# EasyEDA schematic EasyEDA-SCH_IoT-Indoor-Climate-Sensor-upgraded_2025-12-03.json
TITLE: Indoor-Climate-Sensor; REV: 2.0; Date: 2025-01-12; Sheet: 1/1; Company: H4 - D15
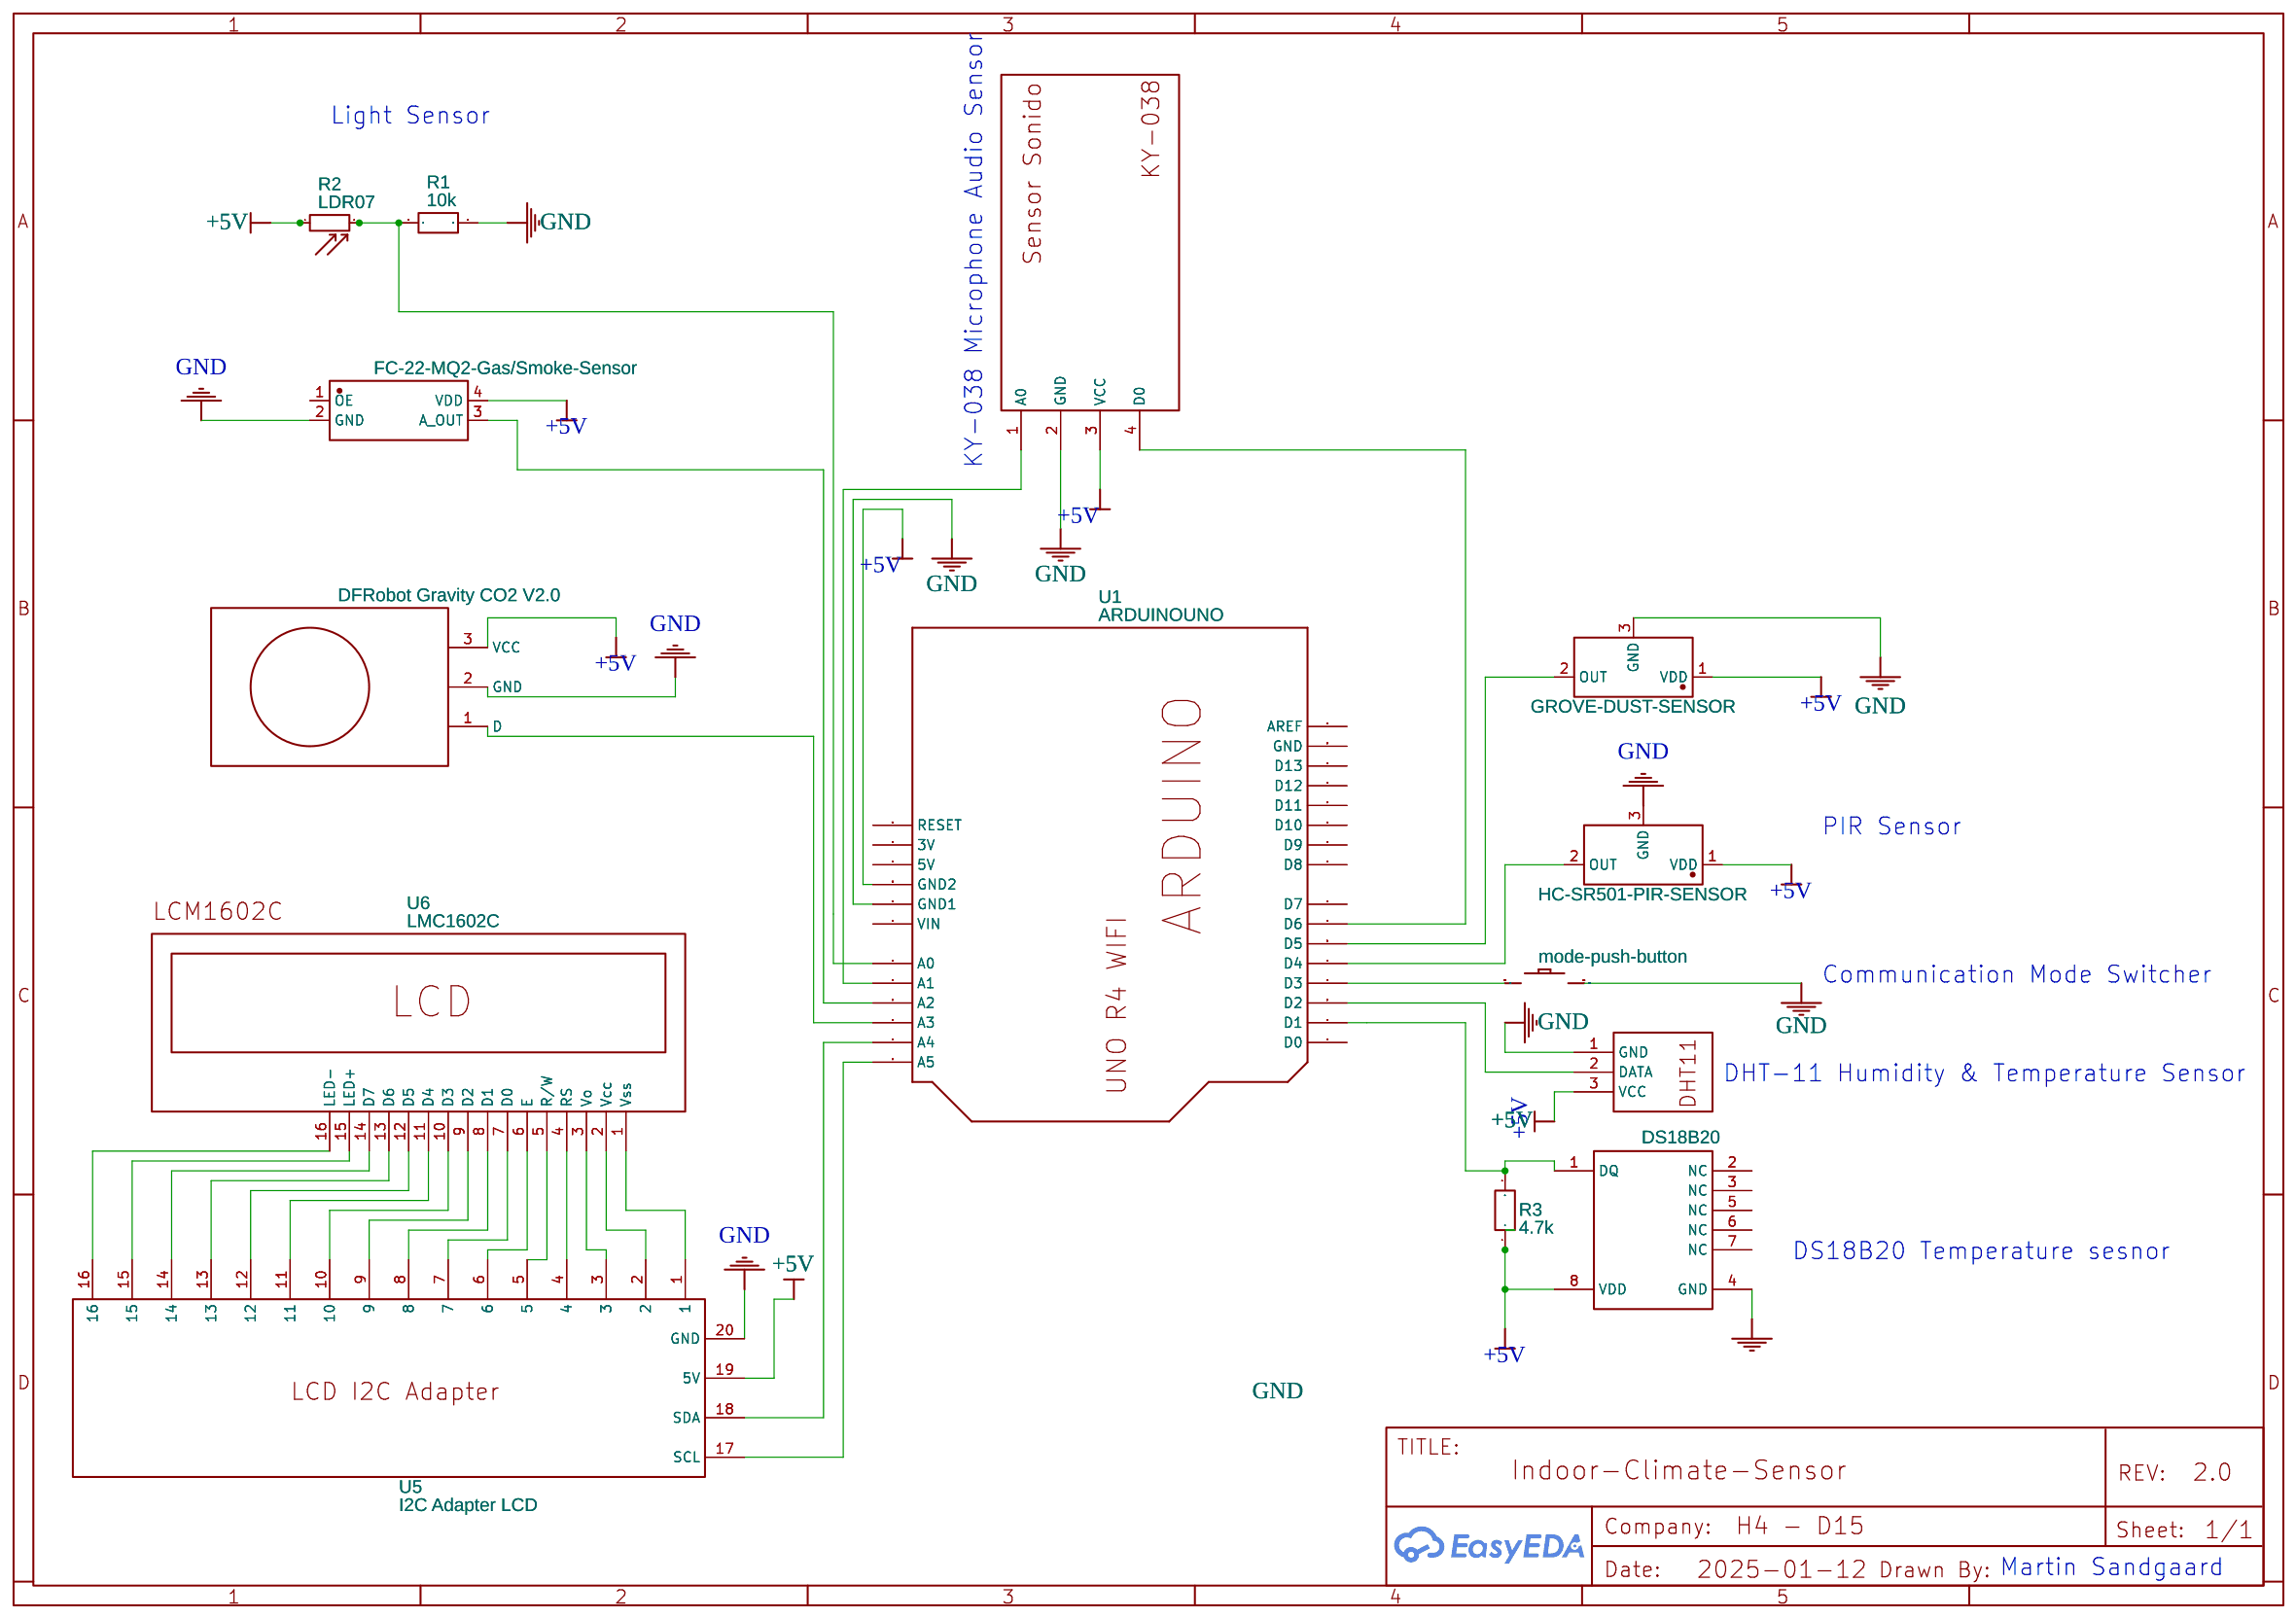
[diagram p0: schematic sheet]

## Parts
1  mode-push-button  [32TEETH---CONDUCTIVE-BUTTONS_CONDUCTIVE_BUTTON_DIRECTIONAL_THICK]
GROVE-DUST-SENSOR  EKMB1309113K  [PIR-TH_EKMB4308112K]
HC-SR501-PIR-SENSOR  EKMB1309113K  [PIR-TH_EKMB4308112K]
OSC1  FC-22-MQ2-Gas/Smoke-Sensor  [OSC-SMD_4P-L2.5-W2.0-BL-B]
R1  10k  [R0603]
R2  LDR07  [RESISTOR_LDR_5.1X4.3_RM3.4]
R3  4.7k  [R0603]
U1  ARDUINOUNO  [ARDUINO]
U2  DS18B20  [MAXM-U8+1_N]
U3  KY-038 Microphone Sound Sensor  [KY-037 KY-038 SENSOR SONIDO KY]
U4  DHT-11  [DHT-11]
U5  I2C Adapter LCD  [LCDI2CADAPTER]
U6  LMC1602C  [LCD-1602]
U7  DFRobot Gravity CO2 V2.0

## Library data of the parts
1 = button: Contributor: ericcaf
GROVE-DUST-SENSOR HC-SR501-PIR-SENSOR = EKMB1309113K: Contributor: lcsc; Supplier: LCSC; Supplier Part: C3678642; Manufacturer: PANASONIC(松下)
OSC1 = AMPMDFC-22.0000T3: Contributor: lcsc; Supplier: LCSC; Supplier Part: C2037761; Manufacturer: ABRACON; JLCPCB Part Class: Extended Part
R1 R3 = R_0603_EU: Contributor: LCEDA_Lib
R2 = LDR07: Contributor: KiCAD; license: https://www.gnu.org/licenses/lgpl-2.1.html
U1 = ARDUINOUNO: Arduino DiecimilaDuemilanove; Contributor: Adafruit
U2 = DS18B20U+: High-Precision 1-Wire Digital Thermometer, -55 to 125 degC, 8-Pin SOP (U8+1), Pb-Free
U3 = KY-037 KY038 SENSOR SONIDO COPY: Contributor: DARIOELJATIB
U4 = DHT-11: Contributor: abedallww
U5 = I2C Adapter LCD: Contributor: Dodger-j
U6 = LMC1602C: Contributor: chenxiebj
U7 = DFRobot Gravity - czujnik dwutlenku węgla CO2 - elektrochemiczny: Contributor: cameraatliberty

## Nets
+5V: GROVE-DUST-SENSOR.1(VDD) HC-SR501-PIR-SENSOR.1(VDD) OSC1.4(VDD) R2.1 R3.1 U1.GND2 U2.8(VDD) U3.3(VCC) U4.3(VCC) U5.19(5V)
GND: 1.P$ACTIVE GROVE-DUST-SENSOR.3(GND) HC-SR501-PIR-SENSOR.3(GND) OSC1.2(GND) R1.1 U1.GND1 U2.4(GND) U3.2(GND) U4.1(GND) U5.20(GND)
Net-(1-P$GND): 1.P$GND U1.D3
Net-(GROVE-DUST-SENSOR-2): GROVE-DUST-SENSOR.2(OUT) U1.D5
Net-(HC-SR501-PIR-SENSOR-2): HC-SR501-PIR-SENSOR.2(OUT) U1.D4
Net-(OSC1-3): OSC1.3(A OUT) U1.A2
Net-(R1-2): R1.2 R2.2 U1.A0
Net-(R3-2): R3.2 U1.D1 U2.1(DQ)
Net-(U1-A1): U1.A1 U3.1(A0)
Net-(U1-A4): U1.A4 U5.18(SDA)
Net-(U1-A5): U1.A5 U5.17(SCL)
Net-(U1-D2): U1.D2 U4.2(DATA)
Net-(U1-D6): U1.D6 U3.4(D0)
Net-(U5-1): U5.1 U6.1(Vss)
Net-(U5-2): U5.2 U6.2(Vcc)
Net-(U5-3): U5.3 U6.3(Vo)
Net-(U5-4): U5.4 U6.4(RS)
Net-(U5-5): U5.5 U6.5(R/W)
Net-(U5-6): U5.6 U6.6(E)
Net-(U5-7): U5.7 U6.7(D0)
Net-(U5-8): U5.8 U6.8(D1)
Net-(U5-9): U5.9 U6.9(D2)
Net-(U5-10): U5.10 U6.10(D3)
Net-(U5-11): U5.11 U6.11(D4)
Net-(U5-12): U5.12 U6.12(D5)
Net-(U5-13): U5.13 U6.13(D6)
Net-(U5-14): U5.14 U6.14(D7)
Net-(U5-15): U5.15 U6.15(LED+)
Net-(U5-16): U5.16 U6.16(LED-)

Not connected (* = marked no-connect by the designer): OSC1 1(OE); U1 3V 5V A3 AREF D0 D7 D8 D9 D10 D11 D12 D13 GND RESET VIN; U2 2(NC) 3(NC) 5(NC) 6(NC) 7(NC); U7 1(D) 2(GND) 3(VCC)

## Notes on the sheet
- Light Sensor
- KY-038 Microphone Audio Sensor
- PIR Sensor
- Communication Mode Switcher
- DHT-11 Humidity & Temperature Sensor
- +5V
- DS18B20 Temperature sesnor
- Martin Sandgaard
